# Altium project CPCIS_PWR_MOD_AC.PrjPCB (part 1 of 2)
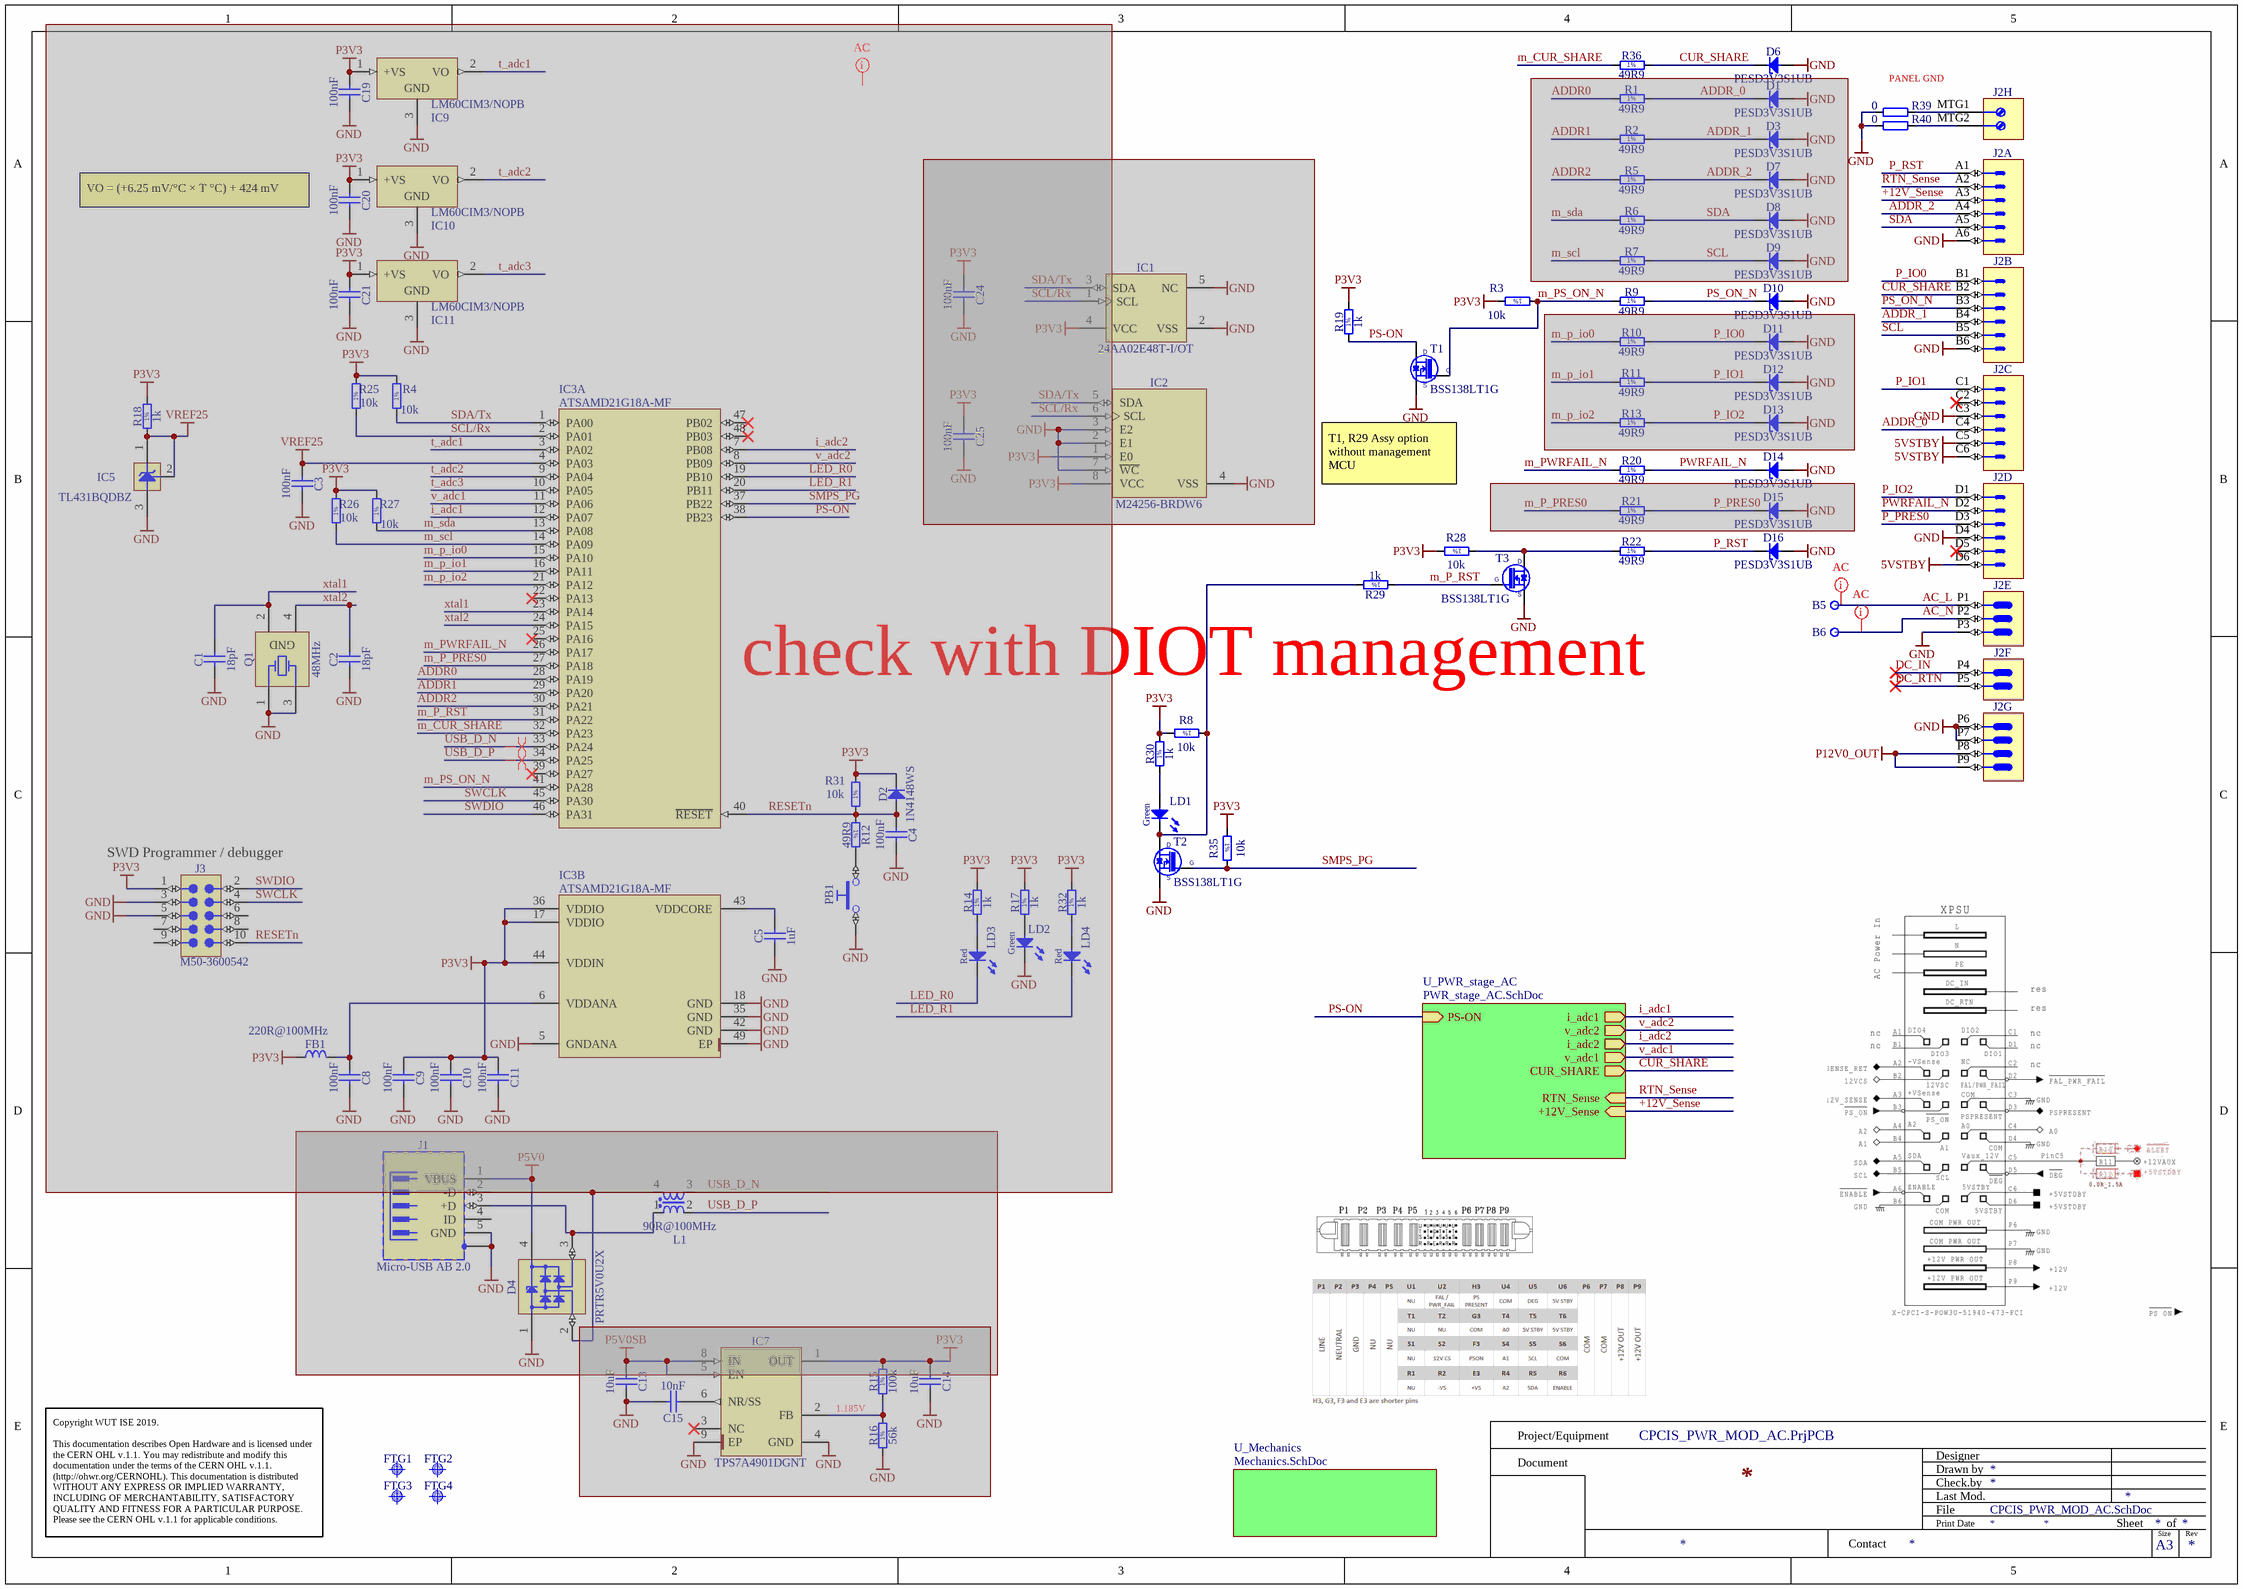
[diagram p0: CPCIS_PWR_MOD_AC.SchDoc]
4 sheets, 206 parts. Net scope: hierarchical (ports join the sheet entries above them; power ports are global).
Board file: CPCIS_PWR_MOD_AC.pcbdoc
Sheets:
  CPCIS_PWR_MOD_AC.SchDoc
    U_PWR_stage_AC = PWR_stage_AC.SchDoc
      U_LED_bargraph = LED_bargraph.SchDoc
    U_Mechanics = Mechanics.SchDoc

## Sheet CPCIS_PWR_MOD_AC.SchDoc
size 420 x 297 mm

### Parts
(Parts that share a designator on the sheet are numbered #1, #2 ... from top to bottom, then left to right.)
B5  Plated Hole  [c220h150]  (value not drawn)  (no BOM)
B6  Plated Hole  [c220h150]  (value not drawn)  (no BOM)
C1#1  18pF  [CAPC1005X55N]  (masked out: inside a compile mask, not in the netlist)
C2#1  18pF  [CAPC1005X55N]  (masked out: inside a compile mask, not in the netlist)
C3#1  100nF  [CAPC1005X55N]  (masked out: inside a compile mask, not in the netlist)
C4#1  100nF  [CAPC1005X55N]  (masked out: inside a compile mask, not in the netlist)
C5#1  1uF  [CAPC1608X87N]  (masked out: inside a compile mask, not in the netlist)
C8#1  100nF  [CAPC1005X55N]  (masked out: inside a compile mask, not in the netlist)
C9#1  100nF  [CAPC1005X55N]  (masked out: inside a compile mask, not in the netlist)
C10  100nF  [CAPC1005X55N]  (masked out: inside a compile mask, not in the netlist)
C11  100nF  [CAPC1005X55N]  (masked out: inside a compile mask, not in the netlist)
C13  10uF  [CAPC2012X135N]  (masked out: inside a compile mask, not in the netlist)
C14  10uF  [CAPC2012X135N]  (masked out: inside a compile mask, not in the netlist)
C15  10nF  [CAPC1005X55N]  (masked out: inside a compile mask, not in the netlist)
C19  100nF  [CAPC1005X55N]  (masked out: inside a compile mask, not in the netlist)
C20  100nF  [CAPC1005X55N]  (masked out: inside a compile mask, not in the netlist)
C21  100nF  [CAPC1005X55N]  (masked out: inside a compile mask, not in the netlist)
C24  100nF  [CAPC1005X55N]  (masked out: inside a compile mask, not in the netlist)
C25  100nF  [CAPC1005X55N]  (masked out: inside a compile mask, not in the netlist)
D1  PESD3V3S1UB  [SODFL1608X65N]  (masked out: inside a compile mask, not in the netlist)
D2  1N4148WS  [SODFL2512X100N]  (masked out: inside a compile mask, not in the netlist)
D3  PESD3V3S1UB  [SODFL1608X65N]  (masked out: inside a compile mask, not in the netlist)
D4  PRTR5V0U2X  [SOT190P230X110-4N]  (masked out: inside a compile mask, not in the netlist)
D6  PESD3V3S1UB  [SODFL1608X65N]
D7  PESD3V3S1UB  [SODFL1608X65N]  (masked out: inside a compile mask, not in the netlist)
D8  PESD3V3S1UB  [SODFL1608X65N]  (masked out: inside a compile mask, not in the netlist)
D9  PESD3V3S1UB  [SODFL1608X65N]  (masked out: inside a compile mask, not in the netlist)
D10  PESD3V3S1UB  [SODFL1608X65N]
D11  PESD3V3S1UB  [SODFL1608X65N]  (masked out: inside a compile mask, not in the netlist)
D12  PESD3V3S1UB  [SODFL1608X65N]  (masked out: inside a compile mask, not in the netlist)
D13  PESD3V3S1UB  [SODFL1608X65N]  (masked out: inside a compile mask, not in the netlist)
D14  PESD3V3S1UB  [SODFL1608X65N]
D15  PESD3V3S1UB  [SODFL1608X65N]  (masked out: inside a compile mask, not in the netlist)
D16  PESD3V3S1UB  [SODFL1608X65N]
FB1  220R@100MHz  [INDC2012X105N]  (masked out: inside a compile mask, not in the netlist)
FTG1  Use only in PCB  [FIDUCIAL_TOP_C100-200]  (value not drawn)
FTG2  Use only in PCB  [FIDUCIAL_TOP_S100-200]  (value not drawn)
FTG3  Use only in PCB  [FIDUCIAL_TOP_C100-200]  (value not drawn)
FTG4  Use only in PCB  [FIDUCIAL_TOP_S100-200]  (value not drawn)
IC1  24AA02E48T-I/OT  [SOT95P280X145-5N]  (masked out: inside a compile mask, not in the netlist)
IC2  M24256-BRDW6  [SOP65P640X120-8N]  (masked out: inside a compile mask, not in the netlist)
IC3  ATSAMD21G18A-MF  [QFN50P700X700X100-49N-S525]  (parts A,B of 2)  (masked out: inside a compile mask, not in the netlist)
IC5  TL431BQDBZ  [SOT95P250X110-3N]  (masked out: inside a compile mask, not in the netlist)
IC7  TPS7A4901DGNT  [SOP65P490X110-9N-R157X189]  (masked out: inside a compile mask, not in the netlist)
IC9  LM60CIM3/NOPB  [DBZ0003A_M]  (masked out: inside a compile mask, not in the netlist)
IC10  LM60CIM3/NOPB  [DBZ0003A_M]  (masked out: inside a compile mask, not in the netlist)
IC11  LM60CIM3/NOPB  [DBZ0003A_M]  (masked out: inside a compile mask, not in the netlist)
J1  Micro-USB AB 2.0  [HIROSE_ZX62RD-AB-5P8(30)]  (masked out: inside a compile mask, not in the netlist)
J2  PwrBlade  [AMPHENOL_51939-667]  (value not drawn)  (parts A,B,C,D,E,F,G,H of 8)
J3  Manufacturer Part Number: M50-3600542  [HARWIN_M50-3600542]  (hidden comment: Header 10)  (masked out: inside a compile mask, not in the netlist)
L1  90R@100MHz  [IND_MURATA_DLW21S]  (masked out: inside a compile mask, not in the netlist)
LD1  Green  [LED_AVAGO_HSME-C120]
LD2  Green  [LED_AVAGO_HSME-C120]  (masked out: inside a compile mask, not in the netlist)
LD3  Red  [LED_AVAGO_HSMC-C120]  (masked out: inside a compile mask, not in the netlist)
LD4  Red  [LED_AVAGO_HSMC-C120]  (masked out: inside a compile mask, not in the netlist)
PB1  Push Button  [PB_TYCO_FSMSM]  (value not drawn)  (masked out: inside a compile mask, not in the netlist)
Q1  48MHz  [XTAL_TXC_7M]  (masked out: inside a compile mask, not in the netlist)
R1  49R9  [RESC1005X40N]  (masked out: inside a compile mask, not in the netlist)
R2  49R9  [RESC1005X40N]  (masked out: inside a compile mask, not in the netlist)
R3  10k  [RESC1005X40N]
R4  10k  [RESC1005X40N]  (masked out: inside a compile mask, not in the netlist)
R5  49R9  [RESC1005X40N]  (masked out: inside a compile mask, not in the netlist)
R6  49R9  [RESC1005X40N]  (masked out: inside a compile mask, not in the netlist)
R7  49R9  [RESC1005X40N]  (masked out: inside a compile mask, not in the netlist)
R8  10k  [RESC1005X40N]
R9  49R9  [RESC1005X40N]
R10  49R9  [RESC1005X40N]  (masked out: inside a compile mask, not in the netlist)
R11  49R9  [RESC1005X40N]  (masked out: inside a compile mask, not in the netlist)
R12  49R9  [RESC1005X40N]  (masked out: inside a compile mask, not in the netlist)
R13  49R9  [RESC1005X40N]  (masked out: inside a compile mask, not in the netlist)
R14  1k  [RESC1005X40N]  (masked out: inside a compile mask, not in the netlist)
R15  100k  [RESC1005X40N]  (masked out: inside a compile mask, not in the netlist)
R16  56k  [RESC1005X40N]  (masked out: inside a compile mask, not in the netlist)
R17  1k  [RESC1005X40N]  (masked out: inside a compile mask, not in the netlist)
R18  1k  [RESC1005X40N]  (masked out: inside a compile mask, not in the netlist)
R19  1k  [RESC1005X40N]
R20  49R9  [RESC1005X40N]
R21  49R9  [RESC1005X40N]  (masked out: inside a compile mask, not in the netlist)
R22  49R9  [RESC1005X40N]
R25  10k  [RESC1005X40N]  (masked out: inside a compile mask, not in the netlist)
R26  10k  [RESC1005X40N]  (masked out: inside a compile mask, not in the netlist)
R27  10k  [RESC1005X40N]  (masked out: inside a compile mask, not in the netlist)
R28  10k  [RESC1005X40N]
R29  1k  [RESC1005X40N]
R30  1k  [RESC1005X40N]
R31  10k  [RESC1005X40N]  (masked out: inside a compile mask, not in the netlist)
R32  1k  [RESC1005X40N]  (masked out: inside a compile mask, not in the netlist)
R35  10k  [RESC1005X40N]
R36  49R9  [RESC1005X40N]
R39  0  [RESC1608X55N]
R40  0  [RESC1608X55N]
T1  BSS138LT1G  [SOT95P240X110-3N]
T2  BSS138LT1G  [SOT95P240X110-3N]
T3  BSS138LT1G  [SOT95P240X110-3N]

### Sub-sheets
U_Mechanics = Mechanics.SchDoc: no entries
U_PWR_stage_AC = PWR_stage_AC.SchDoc: i_adc1 (out), v_adc2 (out), i_adc2 (out), v_adc1 (out), CUR_SHARE (out), RTN_Sense (in), +12V_Sense (in), PS-ON (in)

### Nets
5VSTBY: J2.C5 J2.C6 J2.D6
GND: D6.2(A) D10.2(A) D14.2(A) D16.2(A) J2.A6 J2.B6 J2.C3 J2.D4 J2.P3 J2.P6 J2.P7 R39.2 R40.2 T1.2(S) T2.2(S) T3.2(S)
P3V3: R3.2 R8.2 R19.2 R28.2 R30.2 R35.1
P12V0_OUT: J2.P8 J2.P9
+12V_Sense: J2.A3 ; sheet U_PWR_stage_AC/+12V_Sense
AC_L: B5.1 J2.P1
AC_N: B6.1 J2.P2
ADDR_0: J2.C4
ADDR_1: J2.B4
ADDR_2: J2.A4
CUR_SHARE: D6.1(C) J2.B2 R36.2 ; sheet U_PWR_stage_AC/CUR_SHARE
DC_IN: J2.P4
DC_RTN: J2.P5
i_adc2: sheet U_PWR_stage_AC/i_adc2
m_CUR_SHARE: R36.1
m_P_RST: R29.1 T3.1(G)
m_PS_ON_N: R3.1 R9.1 T1.1(G)
m_PWRFAIL_N: R20.1
P_IO0: J2.B1
P_IO1: J2.C1
P_IO2: J2.D1
P_PRES0: J2.D3
P_RST: D16.1(C) J2.A1 R22.2
PS-ON: R19.1 T1.3(D) ; sheet U_PWR_stage_AC/PS-ON
PS_ON_N: D10.1(C) J2.B3 R9.2
PWRFAIL_N: D14.1(C) J2.D2 R20.2
RTN_Sense: J2.A2 ; sheet U_PWR_stage_AC/RTN_Sense
SCL: J2.B5
SDA: J2.A5
SMPS_PG: R35.2 T2.1(G)
v_adc2: sheet U_PWR_stage_AC/v_adc2
NetJ2_MTG1: J2.MTG1 R39.1
NetJ2_MTG2: J2.MTG2 R40.1
NetLD1_1: LD1.1(C) R8.1 R29.2 T2.3(D)
NetLD1_2: LD1.2(A) R30.1
NetR22_1: R22.1 R28.1 T3.3(D)

Not connected (* = marked no-connect by the designer): J2 C2* D5*

### Layout directives
net class AC: (no net found under the mark), AC_L, AC_N
differential pair: (no net found under the mark)

### Notes on the sheet
- PANEL GND
- (near C20) VO = (+6.25 mV/°C × T °C) + 424 mV
- T1, R29 Assy option without management MCU
- check with DIOT management
- (near J3) SWD Programmer / debugger
- 1.185V
- Project/Equipment
- Document
- Designer
- Drawn by
- Check.by
- Copyright WUT ISE 2019.
  This documentation describes Open Hardware and is licensed under the CERN OHL v.1.1. You may redistribute and modify this documentation under the terms of the CERN OHL v.1.1. (http://ohwr.org/CERNOHL). This documentation is distributed WITHOUT ANY EXPRESS OR IMPLIED WARRANTY, INCLUDING OF MERCHANTABILITY, SATISFACTORY QUALITY AND FITNESS FOR A PARTICULAR PURPOSE. Please see the CERN OHL v.1.1 for applicable conditions.
- Contact
- File
- Last Mod.
- Print Date
- Sheet
- Size
- A3
- of
- Rev
- (in symbol R0402_1K_1%_0.0625W_100PPM) 1%
- (in symbol R0402_10K_1%_0.0625W_100PPM) 1%
- (in symbol R0402_49R9_1%_0.0625W_100PPM) 1%
- (in symbol R0402_56K_1%_0.0625W_100PPM) 1%
- (in symbol R0402_100K_1%_0.0625W_100PPM) 1%

### Library data of the parts
B5 B6 = PLATED_HOLE1.5_PAD2.2: Single Terminal Socket; Part Description: Plated Through Hole: Hole Dia.=1.5mm Pad Dia.=2.2mm, IPC-7251 Level A; Mounted: No; Part Number: PLATED_HOLE1.5_PAD2.2; Component Type: Standard (No BOM); Pin Count: 1; Family: Plated Hole; Socket: No; SMD: No; Sense: No; Status: None; ComponentHeight: 0mm; HelpURL: Undefined; Author: CERN DEM JLC; CreateDate: 11.05.2017; LatestRevisionDate: 11.05.2017; PackageDescription: Plated Through Hole: Hole Dia.=1.5mm Pad Dia.=2.2mm, IPC-7251 Level A
C1#1 C2#1 = CC0402_18PF_50V_5%_C0G: Non-polarised capacitor; Part Description: SMD Multilayer Chip Ceramic Capacitor; Manufacturer: GENERIC; Manufacturer1 Part Number: C0402C180J5GACTU; Voltage: 50V; TC: C0G/NP0; Tolerance: ±5%; Part Number: CC0402_18PF_50V_5%_C0G; Component Kind: Standard; Component Type: Standard; Pin Count: 2; Value: 18pF; Status: Preferred; Manufacturer Part Number: CC0402_18PF_50V_5%_C0G; Case: 0402; Mounted: Yes; Socket: No; SMD: Yes; Sense: No; Manufacturer1 Example: KEMET; Manufacturer1 ComponentHeight: 0.55mm; HelpURL: \\cern.ch\dfs\Applications\Altium\Datasheets\CC0805_C0G_KEMET_(Commercial Grade).pdf; Author: CERN DEM JLC; CreateDate: 04.10.2016; LatestRevisionDate: 04.10.2016
C3#1 C4#1 C8#1 C9#1 C10 C11 C19-C21 C24 C25 = CC0402_100NF_16V_10%_X7R: Non-polarised capacitor; Part Description: SMD Multilayer Chip Ceramic Capacitor; Manufacturer: GENERIC; Manufacturer1 Part Number: GRM155R71C104KA88D; Voltage: 16V; TC: X7R; Tolerance: ±10%; Part Number: CC0402_100NF_16V_10%_X7R; Component Kind: Standard; Component Type: Standard; Pin Count: 2; Value: 100nF; Status: Not Recommended; Manufacturer Part Number: CC0402_100NF_16V_10%_X7R; Case: 0402; Mounted: Yes; Socket: No; SMD: Yes; Manufacturer1 Example: MURATA; Manufacturer1 ComponentHeight: 0.55mm; HelpURL: \\cern.ch\dfs\Applications\Altium\Datasheets\CC0402_X7R_MURATA_GRM.pdf; Author: CERN DEM JLC; CreateDate: 05.12.2013; LatestRevisionDate: 03.12.2007; Sense: No
C5#1 = CC0603_1UF_16V_10%_X7R: Non-polarised capacitor; Part Description: SMD Multilayer Chip Ceramic Capacitor; Manufacturer: GENERIC; Manufacturer1 Part Number: 223878615663; Voltage: 16V; TC: X7R; Tolerance: ±10%; Part Number: CC0603_1UF_16V_10%_X7R; Component Kind: Standard; Component Type: Standard; Pin Count: 2; Value: 1uF; Status: None; Manufacturer Part Number: CC0603_1uF_16V_10%_X7R; Case: 0603; Mounted: Yes; Socket: No; SMD: Yes; Sense: No; Manufacturer1 Example: YAGEO PHYCOMP; Manufacturer1 ComponentHeight: 0.9mm; HelpURL: \\cern.ch\dfs\Applications\Altium\Datasheets\CC0603_X7R_PHYCOMP.pdf; Author: CERN DEM JLC; CreateDate: 03.12.2007; LatestRevisionDate: 17.04.2015
C13 C14 = CC0805_10UF_16V_10%_X5R: Non-polarised capacitor; Part Description: SMD Multilayer Chip Ceramic Capacitor; Manufacturer: GENERIC; Manufacturer1 Part Number: C0805C106K4PAC; Voltage: 16V; TC: X5R; Tolerance: ±10%; Part Number: CC0805_10UF_16V_10%_X5R; Component Kind: Standard; Component Type: Standard; Pin Count: 2; Value: 10uF; Status: Preferred; Manufacturer Part Number: CC0805_10UF_16V_10%_X5R; Case: 0805; Mounted: Yes; Socket: No; SMD: Yes; Manufacturer1 Example: KEMET; Manufacturer1 ComponentHeight: 1.4mm; HelpURL: \\cern.ch\dfs\Applications\Altium\Datasheets\CC1206_X5R_KEMET.pdf; Author: CERN DEM JLC; CreateDate: 03.12.2007; LatestRevisionDate: 03.12.2007; Sense: No
C15 = CC0402_10NF_50V_10%_X7R: Non-polarised capacitor; Part Description: SMD Multilayer Chip Ceramic Capacitor; Manufacturer: GENERIC; Manufacturer1 Part Number: GRM155R71H103KA88D; Voltage: 50V; TC: X7R; Tolerance: ±10%; Part Number: CC0402_10NF_50V_10%_X7R; Component Kind: Standard; Component Type: Standard; Pin Count: 2; Value: 10nF; Status: None; Manufacturer Part Number: CC0402_10NF_50V_10%_X7R; Case: 0402; Mounted: Yes; Socket: No; SMD: Yes; Sense: No; Manufacturer1 Example: MURATA; Manufacturer1 ComponentHeight: 0.55mm; HelpURL: \\cern.ch\dfs\Applications\Altium\Datasheets\CC0402_X7R_MURATA_GRM.pdf; Author: CERN DEM MR; CreateDate: 08/01/2016; LatestRevisionDate: 08/01/2016
D1 D3 D6-D16 = PESD3V3S1UB: ESD protection diode; Part Description: ESD protection diode (23kV); Manufacturer: NXP SEMICONDUCTORS; Voltage: 3V3; Power: 330W; PressFit: No; Bonding: No; Part Number: PESD3V3S1UB; Component Kind: Standard; Component Type: Standard; Device: PESD3V3S1UB; PackageDescription: Ultra Small Outline Diode Flat Lead (SOD-523), Body; 1.2mm L X 0.8mm W X 0.65mm H, IPC Medium Density; Manufacturer Part Number: PESD3V3S1UB; Pin Count: 2; Case: SOD523; Mounted: Yes; Socket: No; SMD: Yes; Sense: No; ComponentHeight: 0.65mm; HelpURL: \\cern.ch\dfs\Applications\Altium\Datasheets\PESD3V3S1UB.pdf; Author: CERN DEM JLC; CreateDate: 29.11.2012; LatestRevisionDate: 29.11.2012
D2 = 1N4148WS: Diode; Part Description: Small Signal Diodes; Manufacturer: FAIRCHILD SEMICONDUCTOR; Voltage: 75V; Power: 150mA; PressFit: No; Bonding: No; Part Number: 1N4148WS; Component Kind: Standard; Component Type: Standard; Device: 1N4148WS; PackageDescription: SODFL Diode; 1.70mm W X 1.25mm L X 1.00mm H body, IPC Medium Density; Manufacturer Part Number: 1N4148WS; Pin Count: 2; Case: SOD-323F; Mounted: Yes; Socket: No; SMD: Yes; Sense: No; ComponentHeight: 1mm; HelpURL: \\cern.ch\dfs\Applications\Altium\Datasheets\1N4148WS.pdf; Author: CERN DEM JLC; CreateDate: 12.05.2011; LatestRevisionDate: 12.05.2011
D4 = PRTR5V0U2X: Ultra Low Capacitance Double Rail-to-Rail ESD Protection Diode; Part Description: Ultra Low Capacitance (1pF) Double Rail-to-Rail ESD Protection Diode (8kV); Manufacturer: NXP SEMICONDUCTORS; Voltage: 5.5V; PressFit: No; Bonding: No; Table: Diodes; Part Number: PRTR5V0U2X; Component Kind: Standard; Component Type: Standard; Device: PRTR5V0U2X; PackageDescription: SOT143B, SOT, 1.90mm Pitch; 4 Pin, 1.30mm W X 2.90mm L X 1.10mm H body, IPC Medium Density; Manufacturer Part Number: PRTR5V0U2X; Pin Count: 4; Case: SOT143B; Mounted: Yes; Socket: No; SMD: Yes; ComponentHeight: 1.1mm; HelpURL: \\cern.ch\dfs\Applications\Altium\Datasheets\PRTR5V0U2X.pdf; Author: CERN DEM JLC; CreateDate: 2011-03-22; LatestRevisionDate: 2011-03-22
FB1 = IND0805_MURATA_BLM21PG221SN1D: Inductor; Part Description: SMD EMIFIL Suppression Chip Ferrite Bead; Manufacturer: MURATA; Power: 2A; Resistance: 0.05R; Tolerance: ±25%; Table: Inductors SMD; Part Number: IND0805_MURATA_BLM21PG221SN1D; Component Kind: Standard; Component Type: Standard; Pin Count: 2; Value: 220R@100MHz; Status: None; Manufacturer Part Number: BLM21PG221SN1D; Case: 0805; Mounted: Yes; Socket: No; SMD: Yes; ComponentHeight: 1.05mm; HelpURL: \\cern.ch\dfs\Applications\Altium\Datasheets\IND0402_MURATA_BLM21P.pdf; Author: CERN DEM JLC; CreateDate: 2010-01-25; LatestRevisionDate: 2010-01-25
FTG1 FTG3 = FIDUCIAL_TARGET_C100-200: Fiducial Target; Part Description: Round Fiducial Target, Top Layer, 1.0mm, Top Solder 2.0mm, Keepout =2.0mm; Mounted: No; Part Number: FIDUCIAL_TARGET_C100-200; Component Kind: Standard (No BOM); Component Type: Standard (No BOM); Pin Count: 1; Family: Fiducial; Socket: No; SMD: Yes; Sense: No; Status: None; ComponentHeight: 0mm; HelpURL: Undefined; Author: CERN DEM JLC; CreateDate: 09.02.2010; LatestRevisionDate: 04.04.2012; PackageDescription: Round Fiducial Target, Top Layer, 1.0mm, Top Solder 2.0mm, Keepout =2.0mm
FTG2 FTG4 = FIDUCIAL_TARGET_S100-200: Fiducial Target; Part Description: Square Fiducial Target, Top Layer, 1.0mm, Top Solder 2.0mm, Keepout =2.0mm; Mounted: No; Part Number: FIDUCIAL_TARGET_S100-200; Component Kind: Standard (No BOM); Component Type: Standard (No BOM); Pin Count: 1; Family: Fiducial; Socket: No; SMD: Yes; Sense: No; Status: None; ComponentHeight: 0mm; HelpURL: Undefined; Author: CERN DEM JLC; CreateDate: 09.02.2010; LatestRevisionDate: 04.04.2012; PackageDescription: Square Fiducial Target, Top Layer, 1.0mm, Top Solder 2.0mm, Keepout =2.0mm
IC1 = 24AA02E48T-I/OT: 1.7V-5.5V, 2K I2C Serial EEPROM With EUI-48 Node Identity; Manufacturer: MICROCHIP TECHNOLOGY; PressFit: No; Bonding: No; Part Number: 24AA02E48T-I/OT; Component Kind: Standard; Component Type: Standard; Device: 24AA02E48T-I/OT; PackageDescription: SOT, 0.95mm pitch; 5 pin, 1.60mm W X 2.90mm L X 1.45mm H body, IPC Medium Density; Part Description: 1.7V-5.5V, 2K I2C Serial EEPROM With EUI-48 Node Identity; Manufacturer Part Number: 24AA02E48T-I/OT; Pin Count: 5; Case: SOT23-5; Mounted: Yes; Socket: No; SMD: Yes; Sense: No; ComponentHeight: 1.45mm; HelpURL: \\cern.ch\dfs\Applications\Altium\Datasheets\24AA02E48T-I-OT.pdf; Author: CERN DEM MR; CreateDate: 31.03.2016; LatestRevisionDate: 31.03.2016
IC2 = MEM_M24256-BRDW6P: 256-Kbit Serial I²C Bus EEPROM; Manufacturer: ST MICROELECTRONICS; PressFit: No; Bonding: No; Part Number: M24256-BRDW6P; Component Kind: Standard; Component Type: Standard; Device: M24256-BRDW6; PackageDescription: SOP, 0.65mm pitch; 8 pin, 4.40mm W X 3.00mm L X 1.20mm H body, IPC Medium Density; Part Description: 256-Kbit Serial I²C Bus EEPROM; Manufacturer Part Number: M24256-BRDW6; Pin Count: 8; Case: TSSOP8; Mounted: Yes; Socket: No; SMD: Yes; Sense: No; ComponentHeight: 1.2mm; HelpURL: \\cern.ch\dfs\Applications\Altium\Datasheets\M24256-BRDW6P.pdf; Author: CERN DEM MR; CreateDate: 17.03.2016; LatestRevisionDate: 17.03.2016
IC3 = ATSAMD21G18A-MF: 32-bit ARM®-based Cortex®-M0+ core Microcontroller, 1.62V to 3.6V, 48MHz, 256KB Flash, 32KB of SRAM, 48 QFN, Industrial Grade (-40°C to 125°C); Part Description: 32-bit ARM®-based Cortex®-M0+ core Microcontroller, 1.62V to 3.6V, 48MHz, 256KB Flash, 32KB SRAM, 48 QFN, Temperature Range -40°C to 125°C; Manufacturer: MICROCHIP; PressFit: No; Bonding: No; Part Number: ATSAMD21G18A-MF; Component Kind: Standard; Component Type: Standard; Device: ATSAMD21G18A-MF; PackageDescription: QFN, 0.50mm Pitch, Square; 48 Pin, 7.00mm L X 7.00mm W X 1mm H Body (W/Thermal Tab 5.25mm X 5.25mm), IPC Medium Density; Manufacturer Part Number: ATSAMD21G18A-MF; Pin Count: 49; Case: QFN48; Mounted: Yes; Socket: No; SMD: Yes; Sense: No; ComponentHeight: 1mm; HelpURL: \\cern.ch\dfs\Applications\Altium\Datasheets\ATSAMD21G18A-MF.pdf; Author: CERN DEM BC; CreateDate: 23.01.2018; LatestRevisionDate: 23.01.2018
IC5 = TL431BQDBZ: Precision Reference 1=Cathode 2=Adj 3=Anode; Part Description: Vref (2.495V) To 36V 0.5% Precision Programmable Reference; Manufacturer: NXP SEMICONDUCTORS; PressFit: No; Bonding: No; Part Number: TL431BQDBZ; Component Kind: Standard; Component Type: Standard; Device: TL431BQDBZ; PackageDescription: SOT23, 0.95mm Pitch; 3 Pin, 1.3mm W X 2.9mm L X 1.1mm H Body, IPC Medium Density; Manufacturer Part Number: TL431BQDBZ; Pin Count: 3; Case: SOT23; Mounted: Yes; Socket: No; SMD: Yes; Sense: No; ComponentHeight: 1.1mm; HelpURL: \\cern.ch\dfs\Applications\Altium\Datasheets\TL431BQDBZ.pdf; Author: CERN DEM MR; CreateDate: 18.04.2016; LatestRevisionDate: 18.04.2016
IC7 = TPS7A4901DGNT: +36V, +150mA, Ultralow-Noise, Positive Linear Regulator; Manufacturer: TEXAS INSTRUMENTS; PressFit: No; Bonding: No; Part Number: TPS7A4901DGNT; Component Kind: Standard; Component Type: Standard; Device: TPS7A4901DGNT; PackageDescription: SOP,0.65mm,pitch; 8 pin,3.00mm W X 3.00mm L X 1.10mm H body (w/thermal tab 1.57 X 1.89 mm), IPC Medium Density; Part Description: +36V, +150mA, Ultralow-Noise, Positive Linear Regulator; Manufacturer Part Number: TPS7A4901DGNT; Pin Count: 9; Case: TSSOP8; Mounted: Yes; Socket: No; SMD: Yes; Sense: No; ComponentHeight: 1.1mm; HelpURL: \\cern.ch\dfs\Applications\Altium\Datasheets\TPS7A4901DGNT.pdf; Author: CERN DEM JLC; CreateDate: 08.03.2011; LatestRevisionDate: 08.03.2011
IC9-IC11 = CMP-0066-00231-3: 2.7V Temperature Sensor, 3-pin SOT-23, Pb-Free; Manufacturer: Texas Instruments; PackageTopMarking: T6C*XTT; PowerWise: N; CompType: Temp Sensor IC; PackageDescription: Molded SOT-23, .115 x .051 x .037in Body, 3 Lead, .075 in Pitch; ComponentLink1URL: http://www.ti.com/general/docs/lit/getliterature.tsp?genericPartNumber=LM60&fileType=pdf; PackageReference: DBZ0003A; PinCount: 3; ComponentLink1Description: Datasheet URL; RoHS: Y
J1 = HIROSE_ZX62RD-AB-5P8(30): 5 Pin + 1 Shield USB Receptacle; Part Description: Micro-USB 2.0 Right Angle, SMD Type AB - Reverse (Top mount), Shell Through Hole; Manufacturer: HIROSE (HRS); PressFit: No; Part Number: HIROSE_ZX62RD-AB-5P8(30); Component Kind: Standard; Component Type: Standard; Pin Count: 7; Family: Micro-USB AB 2.0; Mounted: Yes; Socket: No; SMD: Yes; Sense: No; Status: None; Manufacturer Part Number: ZX62RD-AB-5P8(30); ComponentHeight: 2.35mm; HelpURL: \\cern.ch\dfs\Applications\Altium\Datasheets\HIROSE_ZX62RD-AB-5P8(30).pdf; ComponentLink1URL: \\cern.ch\dfs\Applications\Altium\Datasheets\HIROSE_ZX62RD-AB-5P8(30)_Package-Drawing.pdf; ComponentLink1Description: Package-Drawing; Author: CERN DEM JMW; CreateDate: 22.06.2017; LatestRevisionDate: 22.06.2017
J2 = AMPHENOL_51939-667: Thru-Hole, Lead 3.43mm, PowerBlade Right Angled Power Connector 3ACP 2P 24S 4P Contacts; Part Description: Right Angle PowerBlade Power Connector 3ACP + 2P + 24S + 4P Contacts; PressFit: No; Part Number: AMPHENOL_51939-667; Component Kind: Standard; Component Type: Standard; Pin Count: 33; Family: PwrBlade; Mounted: Yes; Socket: No; SMD: No; Sense: No; Status: None; Manufacturer: AMPHENOL; Manufacturer Part Number: 51939-667; ComponentHeight: 12.57mm; HelpURL: \\cern.ch\dfs\Applications\Altium\Datasheets\AMPHENOL_51939-667.pdf; Author: CERN DEM JLC; CreateDate: 05.03.2019; LatestRevisionDate: 05.03.2019
J3 = CON_2x10 1.27 SMT_male_HARWIN: 10 Contacts - Pitch 1.27mm - Dual Row SMT Vertical Pin Header (Post Lead = 3mm, Insulator 1mm); Manufacturer: HARWIN; PressFit: No; Part Number: HARWIN_M50-3600542; Component Kind: Standard; Component Type: Standard; Pin Count: 10; Family: Header 10; Mounted: Yes; Socket: No; SMD: Yes; Sense: No; Status: None; Part Description: 10 Contacts - Pitch 1.27mm - Dual Row SMT Vertical Pin Header (Post Lead = 3mm, Insulator 1mm); ComponentHeight: 5.13mm; HelpURL: \\cern.ch\dfs\Applications\Altium\Datasheets\HARWIN_M50-3600842.pdf; Author: GK; CreateDate: 15.03.2017; LatestRevisionDate: 22.05.2017
L1 = IND_MURATA_DLW21SN900SQ2L: Inductor Common Mode; Part Description: Wire Wound Common Mode Choke Coil (DLW21S Series); Manufacturer: MURATA; Power: 330mA; Resistance: 0.35R; Tolerance: ±25%; Table: Inductors SMD; Part Number: IND_MURATA_DLW21SN900SQ2L; Component Kind: Standard; Component Type: Standard; Pin Count: 4; Value: 90R@100MHz; Status: None; Manufacturer Part Number: DLW21SN900SQ2L; Case: 0805; Mounted: Yes; Socket: No; SMD: Yes; ComponentHeight: 1.4mm; HelpURL: \\cern.ch\dfs\Applications\Altium\Datasheets\IND_MURATA_DLW21S.pdf; Author: CERN DEM JLC; CreateDate: 2014-07-01; LatestRevisionDate: 2014-07-01
LD1 LD2 = LED_AVAGO_HSME-C120: LED Green 1C 2A; Part Description: High Performance Right Angle Chip Green LED; Manufacturer: AVAGO TECHNOLOGIES; PressFit: No; Bonding: No; Part Number: LED_AVAGO_HSME-C120; Component Kind: Standard; Component Type: Standard; Color: Green; PackageDescription: Green Chip LED, 2-Leads, Body 1.7x1.1mm, Side Emitting Package; Manufacturer Part Number: HSME-C120; Pin Count: 2; Mounted: Yes; Socket: No; SMD: Yes; Sense: No; ComponentHeight: 0.7mm; HelpURL: \\cern.ch\dfs\Applications\Altium\Datasheets\LED_AVAGO_HSME-C120.pdf; ComponentLink1URL: \\cern.ch\dfs\Applications\Altium\Datasheets\LED_AVAGO_HSME-C110_DESIGN-GUIDE.pdf; ComponentLink1Description: Design Guide; Author: CERN DEM JMW; CreateDate: 22.07.2009; LatestRevisionDate: 20.06.2012
LD3 LD4 = LED_AVAGO_HSMC-C120: LED Red 1C 2A; Part Description: High Performance Right Angle Chip Red LED; Manufacturer: AVAGO TECHNOLOGIES; PressFit: No; Bonding: No; Part Number: LED_AVAGO_HSMC-C120; Component Kind: Standard; Component Type: Standard; Color: Red; PackageDescription: Red Chip LED, 2-Leads, Body 1.7x1.1mm, Side Emitting Package; Manufacturer Part Number: HSMC-C120; Pin Count: 2; Mounted: Yes; Socket: No; SMD: Yes; Sense: No; ComponentHeight: 0.7mm; HelpURL: \\cern.ch\dfs\Applications\Altium\Datasheets\LED_AVAGO_HSMC-C120.pdf; ComponentLink1URL: \\cern.ch\dfs\Applications\Altium\Datasheets\LED_AVAGO_HSMC-C120_DESIGN-GUIDE.pdf; ComponentLink1Description: Design Guide; Author: CERN DEM JMW; CreateDate: 22.07.2009; LatestRevisionDate: 20.06.2012
PB1 = PB_TYCO_FSMSM: Push-Button Switch SPDT; Part Description: 12VDC 50mA SPST Tactile  Push-Button Switch; Manufacturer: TYCO ELECTRONICS; Manufacturer Part Number: FSMSM or 1437566-3; PressFit: No; Part Number: PB_TYCO_FSMSM; Component Kind: Standard; Component Type: Standard; Pin Count: 2; PackageDescription: Body 3.5x6.0mm, Pushbutton Switch,  TYCO ALCOSWITCH FSMSM Serie; Family: Push Button; Mounted: Yes; Socket: No; SMD: Yes; Sense: No; Status: None; ComponentHeight: 4.3mm; HelpURL: \\cern.ch\dfs\Applications\Altium\Datasheets\PB_TYCO_FSMSM.pdf; Author: CERN DEM JLC; CreateDate: 30.06.2008; LatestRevisionDate: 21.06.2012
Q1 = XTAL_48MHZ_TXC_7M-48.000MAHV: Crystal 4 pins 1=XTAL Control 2=GND3=XTAL 4=GND; Part Description: ±30ppm 8pF -40°C to +85°C  4 Pins, 3.2x2.5X0.8mm, SMD Sealing Crystal, 7M Series; Manufacturer: TXC CORPORATION; PressFit: No; Bonding: No; Part Number: XTAL_48MHZ_TXC_7M-48.000MAHV; Component Kind: Standard; Component Type: Standard; PackageDescription: 4 Pins, 2.5x3.2mm, SMD Sealing Crystal, 7M Serie; Value: 48MHz; Manufacturer Part Number: 7M-48.000MAHV; Pin Count: 4; Mounted: Yes; Socket: No; SMD: Yes; Sense: No; ComponentHeight: 0.8mm; HelpURL: \\cern.ch\dfs\Applications\Altium\Datasheets\XTAL_TXC_7M.pdf; Author: CERN DEM MR; CreateDate: 30.05.2016; LatestRevisionDate: 30.05.2016
R1 R2 R5-R7 R9-R13 R20-R22 R36 = R0402_49R9_1%_0.0625W_100PPM: Resistor - 1%; Part Description: General Purpose Thick Film Chip Resistor; Manufacturer: GENERIC; Manufacturer1 Part Number: 232270674999L or RC0402FR-0749R9L; TC: ±100ppm/°C; Table: Resistors SMD; Part Number: R0402_49R9_1%_0.0625W_100PPM; Component Kind: Standard; Component Type: Standard; Pin Count: 2; Value: 49R9; Status: Not recommended; Power: 0.0625W; Tolerance: ±1%; Manufacturer Part Number: R0402_49R9_1%_0.0625W_100PPM; Case: 0402; Mounted: Yes; Socket: No; SMD: Yes; Manufacturer1 Example: YAGEO PHYCOMP; Manufacturer1 ComponentHeight: 0.4mm; HelpURL: \\cern.ch\dfs\Applications\Altium\Datasheets\R0402_Phycomp_RC0402.pdf; Author: CERN DEM JLC; CreateDate: 2012-10-24; LatestRevisionDate: 2012-10-24
R3 R4 R8 R25-R28 R31 R35 = R0402_10K_1%_0.0625W_100PPM: Resistor - 1%; Part Description: General Purpose Thick Film Chip Resistor; Manufacturer: GENERIC; Manufacturer1 Part Number: 232270671003L; TC: ±100ppm/°C; Table: Resistors SMD; Part Number: R0402_10K_1%_0.0625W_100PPM; Component Kind: Standard; Component Type: Standard; Pin Count: 2; Value: 10k; Status: Not recommended; Power: 0.0625W; Tolerance: ±1%; Manufacturer Part Number: R0402_10K_1%_0.0625W_100PPM; Case: 0402; Mounted: Yes; Socket: No; SMD: Yes; Manufacturer1 Example: YAGEO PHYCOMP; Manufacturer1 ComponentHeight: 0.4mm; HelpURL: \\cern.ch\dfs\Applications\Altium\Datasheets\R0402_Phycomp_RC0402.pdf; Author: CERN DEM JLC; CreateDate: 2007-12-03; LatestRevisionDate: 2012-10-17
R14 R17-R19 R29 R30 R32 = R0402_1K_1%_0.0625W_100PPM: Resistor - 1%; Part Description: General Purpose Thick Film Chip Resistor; Manufacturer: GENERIC; Manufacturer1 Part Number: 232270671002L; TC: ±100ppm/°C; PressFit: No; Part Number: R0402_1K_1%_0.0625W_100PPM; Component Kind: Standard; Component Type: Standard; Pin Count: 2; Value: 1k; Status: Not Recommended; Power: 0.0625W; Tolerance: ±1%; Manufacturer Part Number: R0402_1K_1%_0.0625W_100PPM; Case: 0402; Mounted: Yes; Sense: No; Socket: No; SMD: Yes; Manufacturer1 Example: YAGEO PHYCOMP; Manufacturer1 ComponentHeight: 0.4mm; HelpURL: \\cern.ch\dfs\Applications\Altium\Datasheets\R0402_Phycomp_RC0402.pdf; Author: CERN DEM JLC; CreateDate: 03.12.2007; LatestRevisionDate: 17.10.2012
R15 = R0402_100K_1%_0.0625W_100PPM: Resistor - 1%; Part Description: General Purpose Thick Film Chip Resistor; Manufacturer: GENERIC; Manufacturer1 Part Number: 232270671004L; TC: ±100ppm/°C; PressFit: No; Part Number: R0402_100K_1%_0.0625W_100PPM; Component Kind: Standard; Component Type: Standard; Pin Count: 2; Value: 100k; Status: Not Recommended; Power: 0.0625W; Tolerance: ±1%; Manufacturer Part Number: R0402_100K_1%_0.0625W_100PPM; Case: 0402; Mounted: Yes; Sense: No; Socket: No; SMD: Yes; Manufacturer1 Example: YAGEO PHYCOMP; Manufacturer1 ComponentHeight: 0.4mm; HelpURL: \\cern.ch\dfs\Applications\Altium\Datasheets\R0402_Phycomp_RC0402.pdf; Author: CERN DEM JLC; CreateDate: 03.12.2007; LatestRevisionDate: 17.10.2012
R16 = R0402_56K_1%_0.0625W_100PPM: Resistor - 1%; Part Description: General Purpose Thick Film Chip Resistor; Manufacturer: GENERIC; Manufacturer1 Part Number: 232270675603L; TC: ±100ppm/°C; PressFit: No; Part Number: R0402_56K_1%_0.0625W_100PPM; Component Kind: Standard; Component Type: Standard; Pin Count: 2; Value: 56k; Status: Not Recommended; Power: 0.0625W; Tolerance: ±1%; Manufacturer Part Number: R0402_56K_1%_0.0625W_100PPM; Case: 0402; Mounted: Yes; Sense: No; Socket: No; SMD: Yes; Manufacturer1 Example: YAGEO PHYCOMP; Manufacturer1 ComponentHeight: 0.4mm; HelpURL: \\cern.ch\dfs\Applications\Altium\Datasheets\R0402_Phycomp_RC0402.pdf; Author: CERN DEM JLC; CreateDate: 03.12.2007; LatestRevisionDate: 17.10.2012
R39 R40 = R0603_0R_JUMPER: Resistor; Part Description: 1A (0.05R Max DC Resistance) Zero Ohm Jumper; Manufacturer: GENERIC; Manufacturer1 Part Number: NRC06Z0; PressFit: No; Part Number: R0603_0R_JUMPER; Component Kind: Standard; Component Type: Standard; Pin Count: 2; Value: 0; Status: Preferred; Manufacturer Part Number: R0603_0R_JUMPER; Case: 0603; Mounted: Yes; Sense: No; Socket: No; SMD: Yes; Manufacturer1 Example: NIC COMPONENT; Manufacturer1 ComponentHeight: 0.55mm; HelpURL: \\cern.ch\dfs\Applications\Altium\Datasheets\R0603_NIC_NRC.pdf; Author: CERN DEM JLC; CreateDate: 03.12.2007; LatestRevisionDate: 13.03.2008
T1-T3 = BSS138LT1G: N-CHANNEL MOSFET WITH DIODE; Part Description: 50V 200mA N-Channel Enhancement Mode Field-Effect Transistor; Manufacturer: ON SEMICONDUCTOR; PressFit: No; Bonding: No; Part Number: BSS138LT1G; Component Kind: Standard; Component Type: Standard; Device: BSS138LT1G; PackageDescription: SOT23 3-Leads, Pitch 0.95mm - Body 1.4x3mm, IPC Medium Density; Manufacturer Part Number: BSS138LT1G; Pin Count: 3; Case: SOT23-3; Mounted: Yes; Socket: No; SMD: Yes; Sense: No; ComponentHeight: 1.11mm; HelpURL: \\cern.ch\dfs\Applications\Altium\Datasheets\BSS138LT1G.pdf; Author: CERN DEM JLC; CreateDate: 23.03.2009; LatestRevisionDate: 23.03.2009